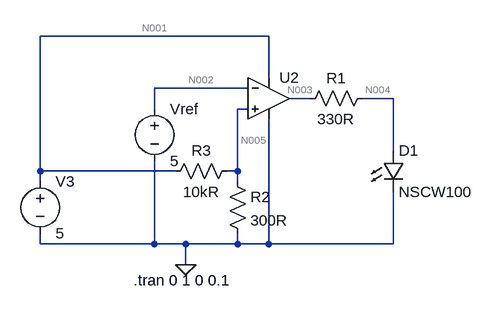
[diagram p0: schematic comparator.asc]
comparator.asc, the LTspice schematic file:
Version 4
SHEET 1 880 680
WIRE 128 -16 -224 -16
WIRE 128 48 128 -16
WIRE 96 64 -48 64
WIRE 192 80 160 80
WIRE 320 80 272 80
WIRE -48 96 -48 64
WIRE 96 96 80 96
WIRE 320 160 320 80
WIRE -224 192 -224 -16
WIRE -16 192 -224 192
WIRE 80 192 80 96
WIRE 80 192 64 192
WIRE -224 208 -224 192
WIRE 80 208 80 192
WIRE -224 304 -224 288
WIRE -48 304 -48 176
WIRE -48 304 -224 304
WIRE 0 304 -48 304
WIRE 80 304 80 288
WIRE 80 304 0 304
WIRE 128 304 128 112
WIRE 128 304 80 304
WIRE 320 304 320 224
WIRE 320 304 128 304
WIRE 0 336 0 304
FLAG 0 336 0
SYMBOL voltage -48 80 R0
WINDOW 123 0 0 Left 2
WINDOW 39 0 0 Left 2
SYMATTR InstName Vref
SYMATTR Value 5
SYMBOL Opamps\\UniversalOpamp2 128 80 R0
SYMATTR InstName U2
SYMBOL voltage -224 192 R0
WINDOW 123 0 0 Left 2
WINDOW 39 0 0 Left 2
SYMATTR InstName V3
SYMATTR Value 5
SYMBOL res 288 64 R90
WINDOW 0 0 56 VBottom 2
WINDOW 3 32 56 VTop 2
SYMATTR InstName R1
SYMATTR Value 330R
SYMBOL LED 304 160 R0
SYMATTR InstName D1
SYMATTR Value NSCW100
SYMATTR Description Diode
SYMATTR Type diode
SYMBOL res 64 192 R0
SYMATTR InstName R2
SYMATTR Value 300R
SYMBOL res 80 176 R90
WINDOW 0 0 56 VBottom 2
WINDOW 3 32 56 VTop 2
SYMATTR InstName R3
SYMATTR Value 10kR
TEXT -80 360 Left 2 !.tran 0 1 0 0.1

The netlist it stands for:
* comparator.asc
Vref N002 0 5
XU2 N005 N002 N001 0 N003 level.2 Avol=1Meg GBW=10Meg Slew=10Meg ilimit=25m rail=0 Vos=0 phimargin=45 en=0 enk=0 in=0 ink=0 Rin=500Meg  ; pins IN+ IN- V+ V- OUT
V3 N001 0 5
R1 N004 N003 330R
D1 N004 0 NSCW100
R2 N005 0 300R
R3 N005 N001 10kR
.model D D
.lib standard.dio
.tran 0 1 0 0.1
.lib UniversalOpamps2.sub
.backanno
.end

* Results of the author's LTspice run, read from the files saved beside the schematic
* Operating Point, zero values left out:
*   V(n002) = 5 V
*   V(n003) = 5.962 µV
*   V(n001) = 5 V
*   V(n005) = 145.6 mV
*   V(n004) = 5.961 µV
*   I(R3) = -485.4 µA
*   I(R2) = 485.4 µA
*   I(V3) = -486 µA
*   I(Vref) = -5 nA
*   Ix(u2:1) = -4.709 nA
*   Ix(u2:2) = 5 nA
*   Ix(u2:3) = 600.8 nA
*   Ix(u2:4) = -526.1 nA
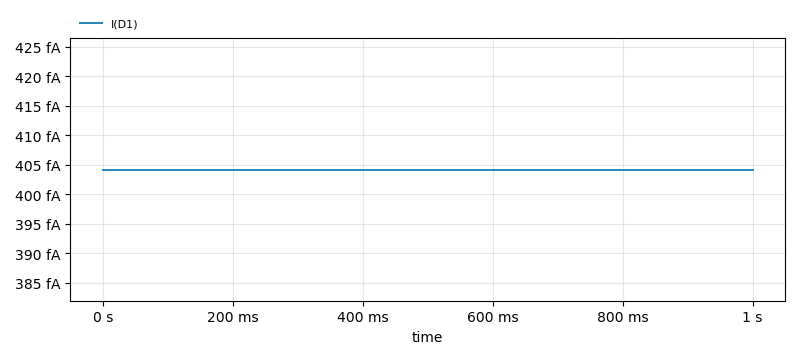
[diagram p1: Transient Analysis of comparator.asc, plotted from the saved traces]
* Transient Analysis, 1 run:
*   I(D1): min 404.2 fA, max 404.2 fA, average 404.2 fA, rms 404.2 fA, last 404.2 fA